# Altium schematic sheet Fast_ADC_Module.SchDoc: Fast_ADC_Module
size A4; ApprovedBy: 阳光电路; CheckedBy: 阳光电路; Author: 阳光电路; CompanyName: 阳光电路; DrawnBy: 阳光电路; Engineer: 阳光电路; Organization: 阳光电路; Address1: 中国; Address2: 桂林; Address3: 阳朔; Address4: 中国 2021; DocumentNumber: 1; Revision: 2.0.0; SheetNumber: 1; SheetTotal: 1
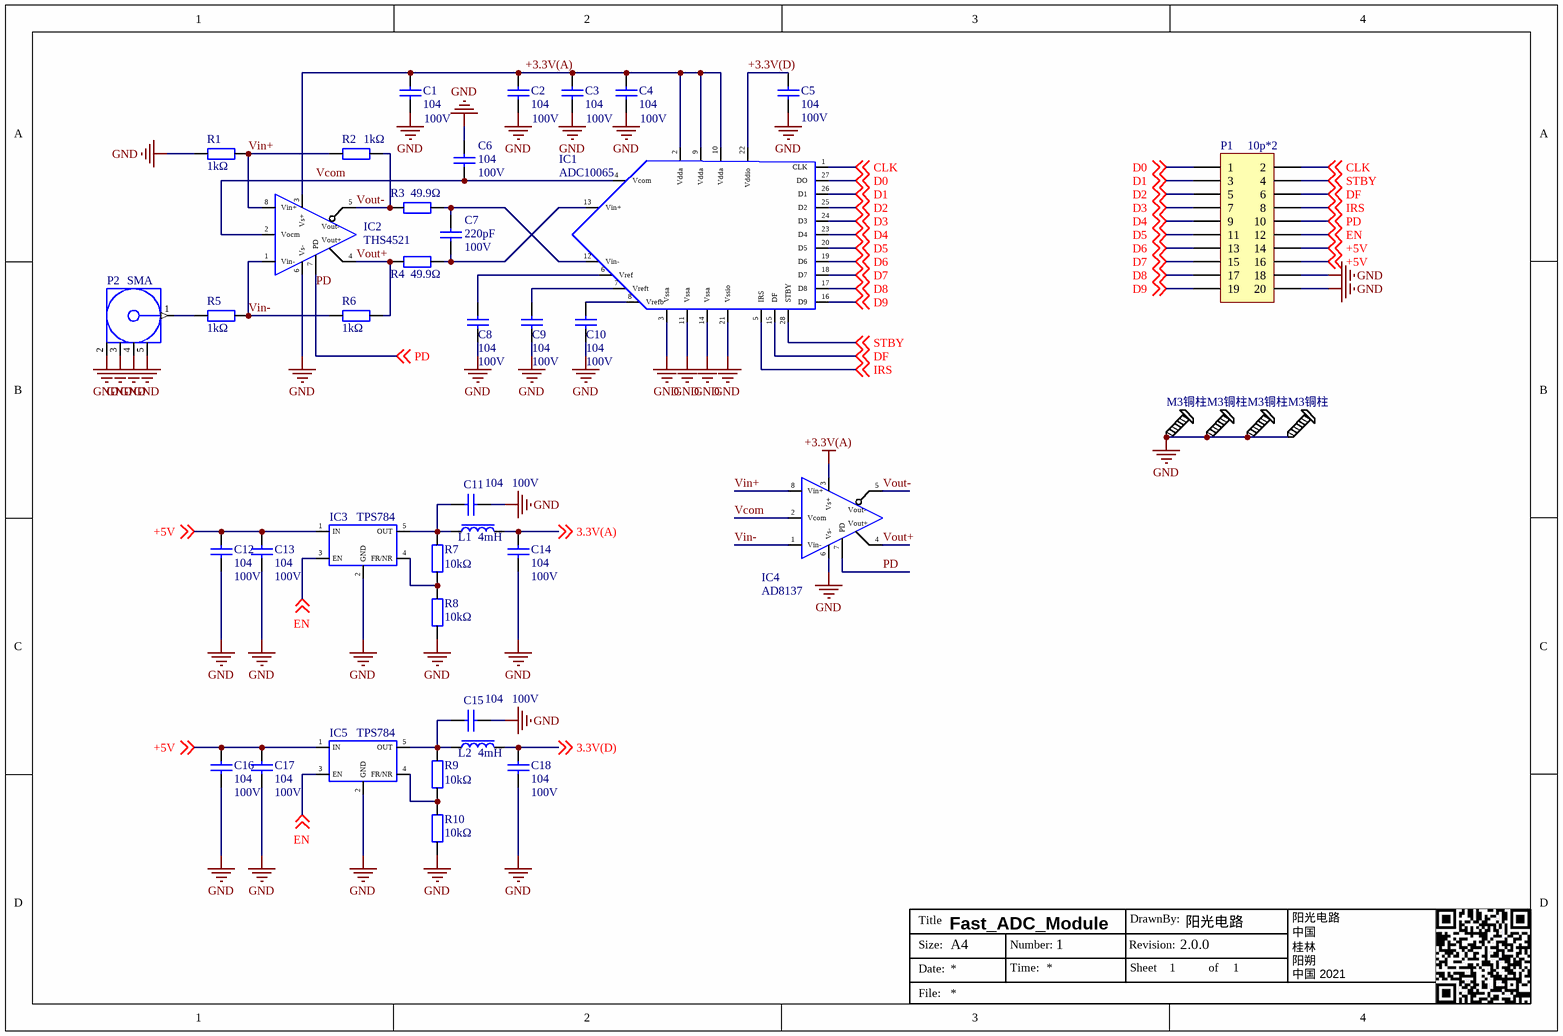
[diagram p0: Fast_ADC_Module.SchDoc]

## Parts
C1  voltage: 100V  [C0603]  (hidden comment: 叠层陶瓷电容)
C2  voltage: 100V  [C0603]  (hidden comment: 叠层陶瓷电容)
C3  voltage: 100V  [C0603]  (hidden comment: 叠层陶瓷电容)
C4  voltage: 100V  [C0603]  (hidden comment: 叠层陶瓷电容)
C5  voltage: 100V  [C0603]  (hidden comment: 叠层陶瓷电容)
C6  voltage: 100V  [C0603]  (hidden comment: 叠层陶瓷电容)
C7  capacity: 220pF  voltage: 100V  [C0603]  (hidden comment: 叠层陶瓷电容)
C8  voltage: 100V  [C0603]  (hidden comment: 叠层陶瓷电容)
C9  voltage: 100V  [C0603]  (hidden comment: 叠层陶瓷电容)
C10  voltage: 100V  [C0603]  (hidden comment: 叠层陶瓷电容)
C11  voltage: 100V  [C0603]  (hidden comment: 叠层陶瓷电容)
C12  voltage: 100V  [C0603]  (hidden comment: 叠层陶瓷电容)
C13  voltage: 100V  [C0603]  (hidden comment: 叠层陶瓷电容)
C14  voltage: 100V  [C0603]  (hidden comment: 叠层陶瓷电容)
C15  voltage: 100V  [C0603]  (hidden comment: 叠层陶瓷电容)
C16  voltage: 100V  [C0603]  (hidden comment: 叠层陶瓷电容)
C17  voltage: 100V  [C0603]  (hidden comment: 叠层陶瓷电容)
C18  voltage: 100V  [C0603]  (hidden comment: 叠层陶瓷电容)
IC1  ADC10065  [TSSOP-28(Wb=4.4mm、 Wl=6.4mm)]
IC2  THS4521  [MSOP-8]
IC3  TSOT-23-5  [TSOT-23-5?]  (value not drawn)
IC4  AD8137  [SOP-8(体宽3.8mm)]
IC5  TSOT-23-5  [TSOT-23-5?]  (value not drawn)
L1  type: 4mH  [R0603]  (hidden comment: 电感)
L2  type: 4mH  [R0603]  (hidden comment: 电感)
P1  10p*2  [HDR2X10]
P2  SMA  [SMA-夹板]
R1  resistance: 1kΩ  [R0603]  (hidden comment: 贴片电阻)
R2  resistance: 1kΩ  [R0603]  (hidden comment: 贴片电阻)
R3  resistance: 49.9Ω  [R0603]  (hidden comment: 贴片电阻)
R4  resistance: 49.9Ω  [R0603]  (hidden comment: 贴片电阻)
R5  resistance: 1kΩ  [R0603]  (hidden comment: 贴片电阻)
R6  resistance: 1kΩ  [R0603]  (hidden comment: 贴片电阻)
R7  贴片电阻  [R0603]  (value not drawn)
R8  贴片电阻  [R0603]  (value not drawn)
R9  贴片电阻  [R0603]  (value not drawn)
R10  贴片电阻  [R0603]  (value not drawn)
S1  M3铜柱  [M3]
S2  M3铜柱  [M3]
S3  M3铜柱  [M3]
S4  M3铜柱  [M3]

## Nets
+3.3V(A): C1.2 C2.2 C3.2 C4.2 IC1.2(Vdda) IC1.9(Vdda) IC1.10(Vdda) IC2.3(Vs+) IC4.3(Vs+)
GND: C1.1 C2.1 C3.1 C4.1 C5.1 C6.2 C8.1 C9.1 C10.1 C11.1 C12.1 C13.1 C14.1 C15.1 C16.1 C17.1 C18.1 IC1.3(Vssa) IC1.11(Vssa) IC1.14(Vssa) IC1.21(Vssio) IC2.6(Vs-) IC3.2(GND) IC4.6(Vs-) IC5.2(GND) P1.18 P1.20 P2.2 P2.3 P2.4 P2.5 R1.1 R8.1 R10.1 S1.1(GND) S2.1(GND) S3.1(GND) S4.1(GND)
3.3V(A): C14.2 L1.1 ; off-sheet 3.3V(A)
3.3V(D): C18.2 L2.1 ; off-sheet 3.3V(D)
+3.3V(D): C5.2 IC1.22(Vddio)
+5V: C12.2 C13.2 C16.2 C17.2 IC3.1(IN) IC5.1(IN) P1.14 P1.16 ; off-sheet +5V
CLK: IC1.1(CLK) P1.2 ; off-sheet CLK
D0: IC1.27(DO) P1.1 ; off-sheet D0
D1: IC1.26(D1) P1.3 ; off-sheet D1
D2: IC1.25(D2) P1.5 ; off-sheet D2
D3: IC1.24(D3) P1.7 ; off-sheet D3
D4: IC1.23(D4) P1.9 ; off-sheet D4
D5: IC1.20(D5) P1.11 ; off-sheet D5
D6: IC1.19(D6) P1.13 ; off-sheet D6
D7: IC1.18(D7) P1.15 ; off-sheet D7
D8: IC1.17(D8) P1.17 ; off-sheet D8
D9: IC1.16(D9) P1.19 ; off-sheet D9
DF: IC1.15(DF) P1.6 ; off-sheet DF
EN: IC3.3(EN) IC5.3(EN) P1.12 ; off-sheet EN
IRS: IC1.5(IRS) P1.8 ; off-sheet IRS
PD: IC2.7(PD) IC4.7(PD) P1.10 ; off-sheet PD
STBY: IC1.28(STBY) P1.4 ; off-sheet STBY
Vcom: C6.1 IC1.4(Vcom) IC2.2(Vocm) IC4.2(Vcom)
Vin+: IC2.8(Vin+) IC4.8(Vin+) R1.2 R2.1
Vin-: IC2.1(Vin-) IC4.1(Vin-) R5.2 R6.1
Vout+: IC2.4(Vout+) IC4.4(Vout+) R4.1 R6.2
Vout-: IC2.5(Vout-) IC4.5(Vout-) R2.2 R3.1
NetC7_1: C7.1 IC1.13(Vin+) R4.2
NetC7_2: C7.2 IC1.12(Vin-) R3.2
NetC8_2: C8.2 IC1.6(Vref)
NetC9_2: C9.2 IC1.7(Vreft)
NetC10_2: C10.2 IC1.8(Vrefb)
NetC11_2: C11.2 IC3.5(OUT) L1.2 R7.2
NetC15_2: C15.2 IC5.5(OUT) L2.2 R9.2
NetIC3_4: IC3.4(FR/NR) R7.1 R8.2
NetIC5_4: IC5.4(FR/NR) R9.1 R10.2
NetP2_1: P2.1 R5.1

## Notes on the sheet
- Title
- DrawnBy:
- Size:
- Date:
- A4
- Number:
- Time:
- Revision:
- Sheet
- of
- File:

## Library data of the parts
C1-C18 = 104: 无极性电容; type: 0805
  C1-C6 C8-C18: capacity: 104
IC1 = ADC10065: 10Bit SAR ADC  65MSPS
IC2 = THS4521: 全差分运算放大器
IC3 IC5 = TPS784: 300mA 5.5V ADJ LDO，TSOT-23-5; package: TSOT-23-5; type: TPS784
IC4 = AD8137: 全差分高速运放，GBW=110MHz，电源电压2.7V~12V，SOP-8; package: SOP-8; type: AD8137
L1 L2 = 470mH: package: 工字电感
P1 = Header 10X2: 10p*2排针
P2 = SMA: 射频座
R1-R10 = 10kΩ: 贴片/直插电阻; package: 0805
  R7-R10: resistance: 10kΩ